# Altium schematic sheet PageTete.SchDoc: Schema Bloc
size Letter; ApprovedBy: Kevin Cotton; Author: Jessica Di Stefano; Revision: B; SheetNumber: 1; SheetTotal: 7
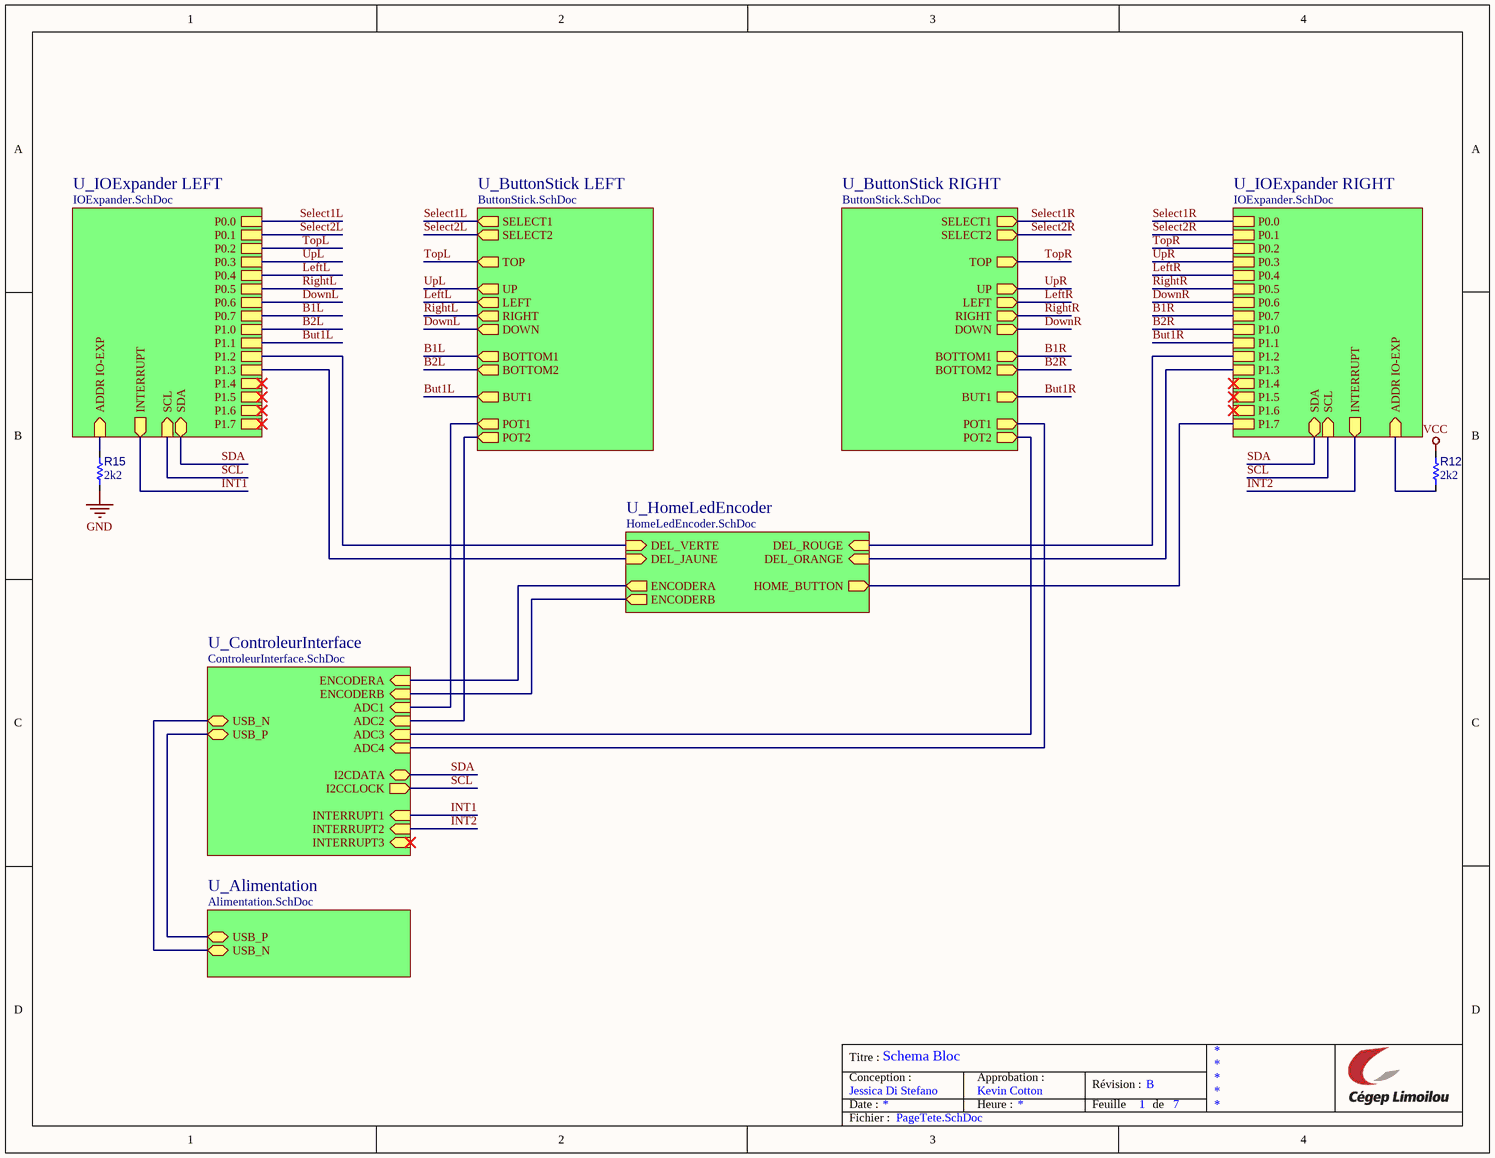
[diagram p0: PageTete.SchDoc]

## Parts
R12  value 2k2  [R_1005[0402]]  (hidden comment: Res 2k2 1% 0402)
R15  value 2k2  [R_1005[0402]]  (hidden comment: Res 2k2 1% 0402)

## Sub-sheets
U_Alimentation = Alimentation.SchDoc: USB_P (bidir), USB_N (bidir)
U_ButtonStick LEFT = ButtonStick.SchDoc: BOTTOM1 (out), UP (out), LEFT (out), SELECT1 (out), TOP (out), BOTTOM2 (out), RIGHT (out), DOWN (out), SELECT2 (out), POT2 (out), POT1 (out), BUT1 (out)
U_ButtonStick RIGHT = ButtonStick.SchDoc: BOTTOM1 (out), UP (out), LEFT (out), SELECT1 (out), TOP (out), BOTTOM2 (out), RIGHT (out), DOWN (out), SELECT2 (out), POT2 (out), POT1 (out), BUT1 (out)
U_ControleurInterface = ControleurInterface.SchDoc: USB_N (bidir), USB_P (bidir), ADC1 (in), ADC2 (in), ADC3 (in), ADC4 (in), INTERRUPT1 (in), INTERRUPT2 (in), INTERRUPT3 (in), ENCODERB (in), ENCODERA (in), I2CDATA (bidir), I2CCLOCK (out)
U_HomeLedEncoder = HomeLedEncoder.SchDoc: DEL_VERTE (in), DEL_ORANGE (in), DEL_JAUNE (in), DEL_ROUGE (in), ENCODERA (out), ENCODERB (out), HOME_BUTTON (out)
U_IOExpander LEFT = IOExpander.SchDoc: P0.0, P0.1, P0.2, P0.3, P0.4, P0.5, P0.6, P0.7, P1.0, P1.1, P1.2, P1.3, P1.4, P1.5, P1.6, P1.7, ADDR IO-EXP (in), SCL (in), SDA (bidir), INTERRUPT (out)
U_IOExpander RIGHT = IOExpander.SchDoc: P0.0, P0.1, P0.2, P0.3, P0.4, P0.5, P0.6, P0.7, P1.0, P1.1, P1.2, P1.3, P1.4, P1.5, P1.6, P1.7, ADDR IO-EXP (in), SCL (in), SDA (bidir), INTERRUPT (out)

## Nets
GND: R15.1
VCC: R12.2
B1L: sheet U_ButtonStick LEFT/BOTTOM1, sheet U_IOExpander LEFT/P0.7
B1R: sheet U_ButtonStick RIGHT/BOTTOM1, sheet U_IOExpander RIGHT/P0.7
B2L: sheet U_ButtonStick LEFT/BOTTOM2, sheet U_IOExpander LEFT/P1.0
B2R: sheet U_ButtonStick RIGHT/BOTTOM2, sheet U_IOExpander RIGHT/P1.0
But1L: sheet U_ButtonStick LEFT/BUT1, sheet U_IOExpander LEFT/P1.1
But1R: sheet U_ButtonStick RIGHT/BUT1, sheet U_IOExpander RIGHT/P1.1
DownL: sheet U_ButtonStick LEFT/DOWN, sheet U_IOExpander LEFT/P0.6
DownR: sheet U_ButtonStick RIGHT/DOWN, sheet U_IOExpander RIGHT/P0.6
INT1: sheet U_ControleurInterface/INTERRUPT1, sheet U_IOExpander LEFT/INTERRUPT
INT2: sheet U_ControleurInterface/INTERRUPT2, sheet U_IOExpander RIGHT/INTERRUPT
LeftL: sheet U_ButtonStick LEFT/LEFT, sheet U_IOExpander LEFT/P0.4
LeftR: sheet U_ButtonStick RIGHT/LEFT, sheet U_IOExpander RIGHT/P0.4
RightL: sheet U_ButtonStick LEFT/RIGHT, sheet U_IOExpander LEFT/P0.5
RightR: sheet U_ButtonStick RIGHT/RIGHT, sheet U_IOExpander RIGHT/P0.5
SCL: sheet U_ControleurInterface/I2CCLOCK, sheet U_IOExpander LEFT/SCL, sheet U_IOExpander RIGHT/SCL
SDA: sheet U_ControleurInterface/I2CDATA, sheet U_IOExpander LEFT/SDA, sheet U_IOExpander RIGHT/SDA
Select1L: sheet U_ButtonStick LEFT/SELECT1, sheet U_IOExpander LEFT/P0.0
Select1R: sheet U_ButtonStick RIGHT/SELECT1, sheet U_IOExpander RIGHT/P0.0
Select2L: sheet U_ButtonStick LEFT/SELECT2, sheet U_IOExpander LEFT/P0.1
Select2R: sheet U_ButtonStick RIGHT/SELECT2, sheet U_IOExpander RIGHT/P0.1
TopL: sheet U_ButtonStick LEFT/TOP, sheet U_IOExpander LEFT/P0.2
TopR: sheet U_ButtonStick RIGHT/TOP, sheet U_IOExpander RIGHT/P0.2
UpL: sheet U_ButtonStick LEFT/UP, sheet U_IOExpander LEFT/P0.3
UpR: sheet U_ButtonStick RIGHT/UP, sheet U_IOExpander RIGHT/P0.3
NetR12_1: R12.1 ; sheet U_IOExpander RIGHT/ADDR IO-EXP
NetR15_2: R15.2 ; sheet U_IOExpander LEFT/ADDR IO-EXP
(unnamed): sheet U_Alimentation/USB_P, sheet U_ControleurInterface/USB_P
(unnamed): sheet U_Alimentation/USB_N, sheet U_ControleurInterface/USB_N
(unnamed): sheet U_ButtonStick LEFT/POT2, sheet U_ControleurInterface/ADC2
(unnamed): sheet U_ButtonStick LEFT/POT1, sheet U_ControleurInterface/ADC1
(unnamed): sheet U_ControleurInterface/ADC3, sheet U_ButtonStick RIGHT/POT2
(unnamed): sheet U_ControleurInterface/ADC4, sheet U_ButtonStick RIGHT/POT1
(unnamed): sheet U_ControleurInterface/ENCODERB, sheet U_HomeLedEncoder/ENCODERB
(unnamed): sheet U_ControleurInterface/ENCODERA, sheet U_HomeLedEncoder/ENCODERA
(unnamed): sheet U_HomeLedEncoder/DEL_VERTE, sheet U_IOExpander LEFT/P1.2
(unnamed): sheet U_HomeLedEncoder/DEL_ORANGE, sheet U_IOExpander RIGHT/P1.3
(unnamed): sheet U_HomeLedEncoder/DEL_JAUNE, sheet U_IOExpander LEFT/P1.3
(unnamed): sheet U_HomeLedEncoder/DEL_ROUGE, sheet U_IOExpander RIGHT/P1.2
(unnamed): sheet U_HomeLedEncoder/HOME_BUTTON, sheet U_IOExpander RIGHT/P1.7

## Notes on the sheet
- Titre :
- Conception :
- Date :
- Approbation :
- Heure :
- Révision :
- Feuille
- de
- Fichier :

## Library data of the parts
R12 R15 = RES008: Resistor type 1; Manufacturer 1: Yageo; Manufacturer Part Number 1: RC0402FR-072K2L; Puissance: 1/16W; Max Working Voltage: 50V; LibRef: RES008; Tolerance: 1%; Mount: SMT; Supplier 1: LCSC; Supplier Part Number 1: C114762; Supplier 2: Digi-Key; Supplier Part Number 2: 311-2.20KLRCT-ND